# EAGLE design milligrids_v05_single board (EAGLE 6.6.0)
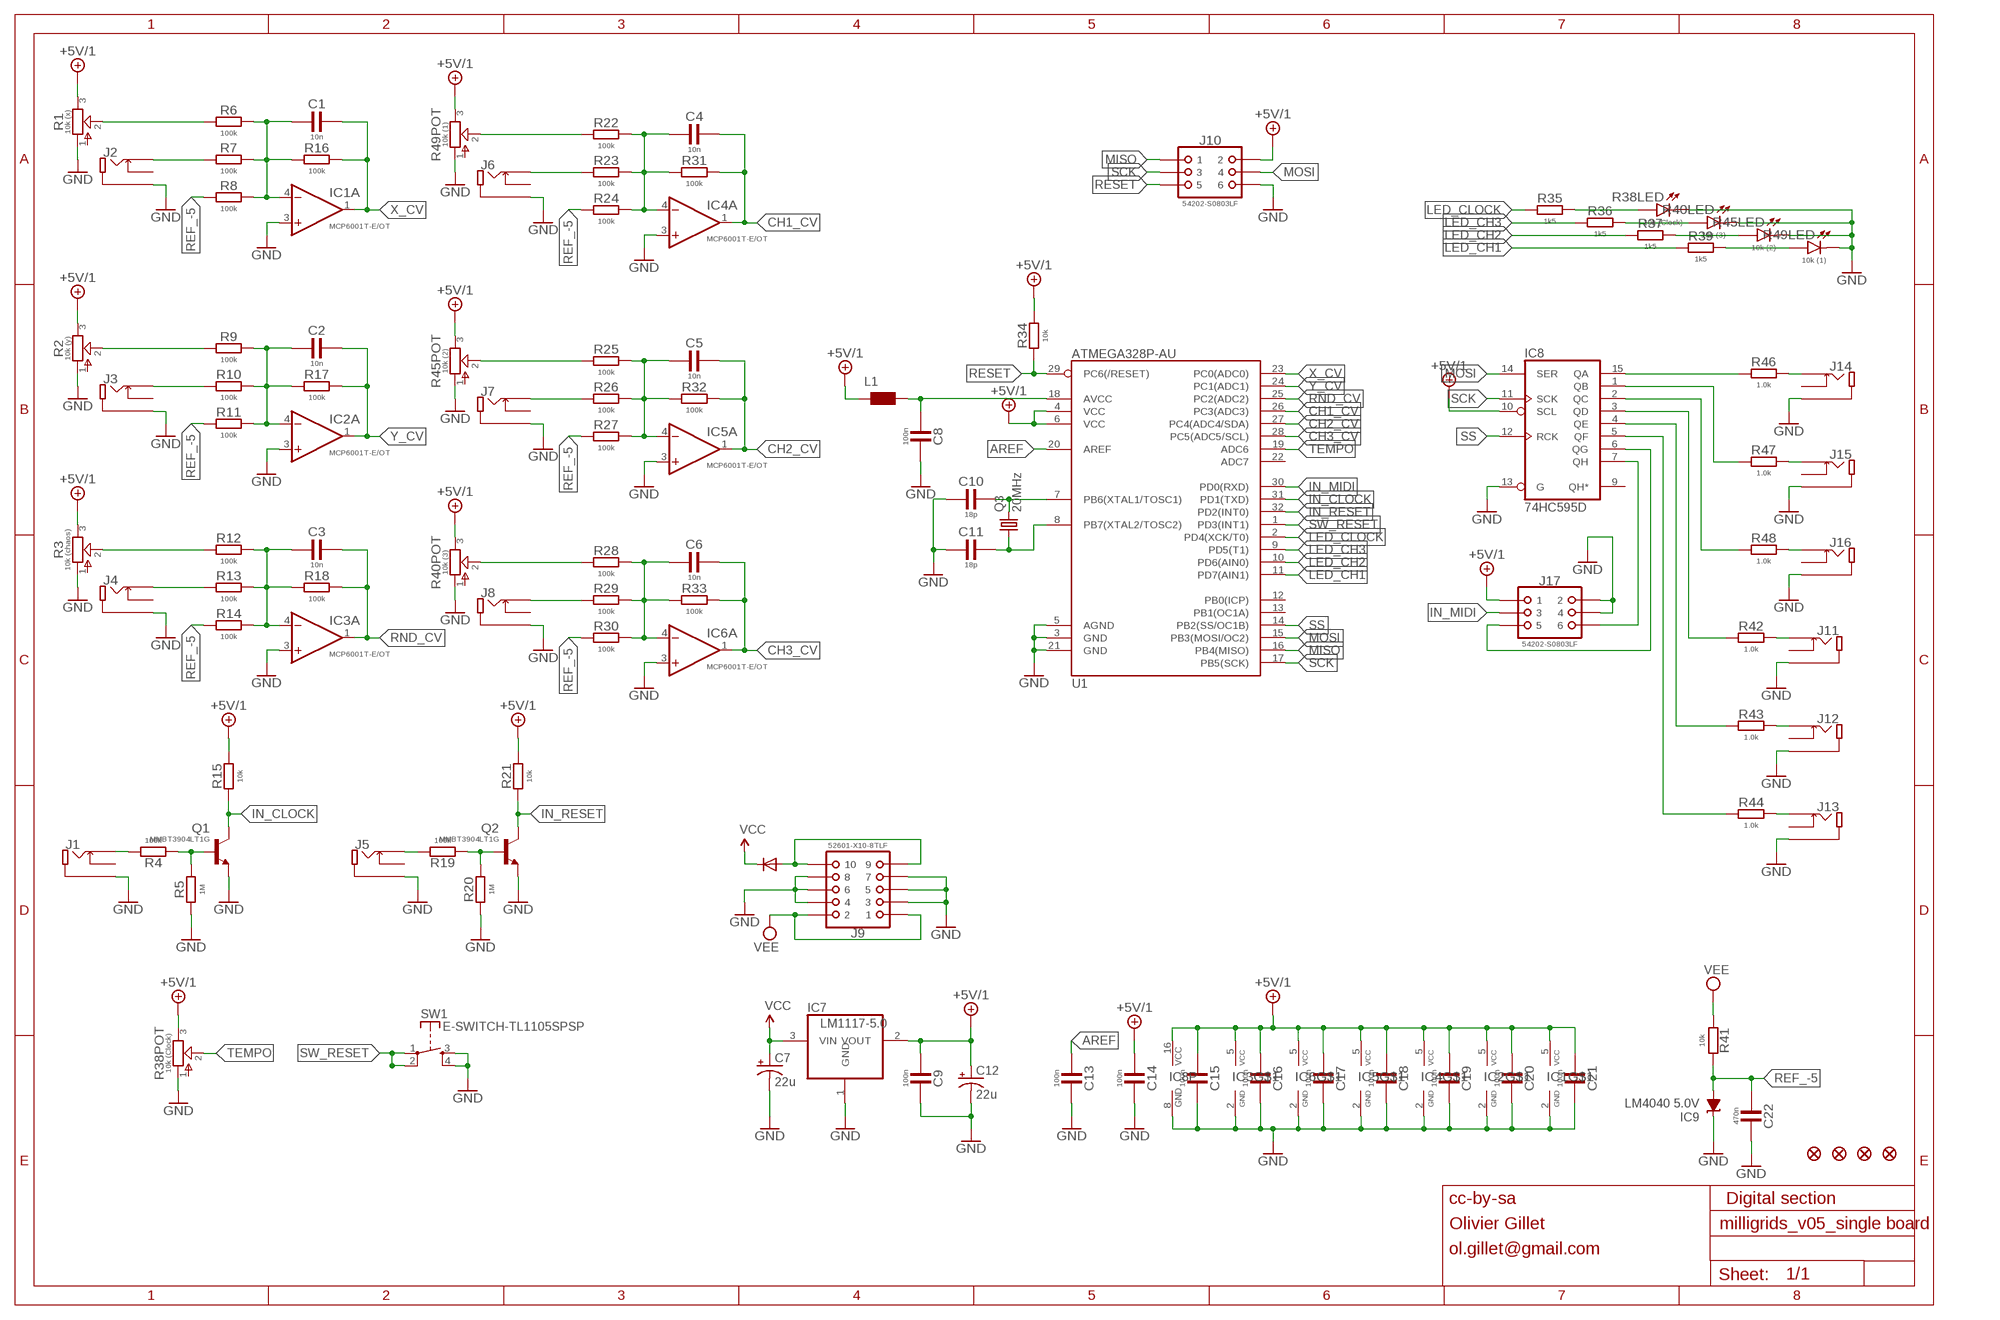
[diagram p0: schematic, sheet 1]

## Parts
C1  10n  C0805  [C0805]
C2  10n  C0805  [C0805]
C3  10n  C0805  [C0805]
C4  10n  C0603  [C0603]
C5  10n  C0603  [C0603]
C6  10n  C0603  [C0603]
C7  22u  CPOL-USC  [PANASONIC_C]
C8  100n  C0805  [C0805]
C9  100n  C0805  [C0805]
C10  18p  C0603  [C0603]
C11  18p  C0603  [C0603]
C12  22u  CPOL-USC  [PANASONIC_C]
C13  100n  C0805  [C0805]
C14  100n  C0805  [C0805]
C15  100n  C0805  [C0805]
C16  100n  C0805  [C0805]
C17  100n  C0805  [C0805]
C18  100n  C0805  [C0805]
C19  100n  C0805  [C0805]
C20  100n  C0805  [C0805]
C21  100n  C0805  [C0805]
C22  470n  C0805  [C0805]
D1  1N5819HW  DIODE-SOD123  [SOD123]
IC1  MCP6001T-E/OT  [SOT23-5]
IC2  MCP6001T-E/OT  [SOT23-5]
IC3  MCP6001T-E/OT  [SOT23-5]
IC4  MCP6001T-E/OT  [SOT23-5]
IC5  MCP6001T-E/OT  [SOT23-5]
IC6  MCP6001T-E/OT  [SOT23-5]
IC7  LM1117-5.0  REG1117  [SOT223]
IC8  74HC595D  [SO16]
IC9  LM4040 5.0V  LM4041C12DBZ  [DBZ_R-PDSO-G3]
J1  WQP-PJ301M6(THONKICONN)  [WQP-PJ301M6(THONKICONN)]
J2  WQP-PJ301M6(THONKICONN)  [WQP-PJ301M6(THONKICONN)]
J3  WQP-PJ301M6(THONKICONN)  [WQP-PJ301M6(THONKICONN)]
J4  WQP-PJ301M6(THONKICONN)  [WQP-PJ301M6(THONKICONN)]
J5  WQP-PJ301M6(THONKICONN)  [WQP-PJ301M6(THONKICONN)]
J6  WQP-PJ301M6(THONKICONN)  [WQP-PJ301M6(THONKICONN)]
J7  WQP-PJ301M6(THONKICONN)  [WQP-PJ301M6(THONKICONN)]
J8  WQP-PJ301M6(THONKICONN)  [WQP-PJ301M6(THONKICONN)]
J9  52601-X10-8TLF  [52601-(X)10-8TLF]
J10  54202-S0803LF  [54202-S0803LF]
J11  WQP-PJ301M6(THONKICONN)  [WQP-PJ301M6(THONKICONN)]
J12  WQP-PJ301M6(THONKICONN)  [WQP-PJ301M6(THONKICONN)]
J13  WQP-PJ301M6(THONKICONN)  [WQP-PJ301M6(THONKICONN)]
J14  WQP-PJ301M6(THONKICONN)  [WQP-PJ301M6(THONKICONN)]
J15  WQP-PJ301M6(THONKICONN)  [WQP-PJ301M6(THONKICONN)]
J16  WQP-PJ301M6(THONKICONN)  [WQP-PJ301M6(THONKICONN)]
J17  54202-S0803LF  [54202-S0803LF]
JP2  FIDUCIAL1X2  [FIDUCIAL-1X2]
JP3  FIDUCIAL1X2  [FIDUCIAL-1X2]
JP4  FIDUCIAL1X2  [FIDUCIAL-1X2]
JP5  FIDUCIAL1X2  [FIDUCIAL-1X2]
L1  WE-CBF_0603  [0603]
Q1  MMBT3904LT1G  [SOT23-3]
Q2  MMBT3904LT1G  [SOT23-3]
Q3  20MHz  CRYSTALHC49UP  [HC49UP]
R1  10k (x)  SONGHUEI-RK0914  [SONGHUEI-RK0914]
R2  10k (y)  SONGHUEI-RK0914  [SONGHUEI-RK0914]
R3  10k (chaos)  SONGHUEI-RK0914  [SONGHUEI-RK0914]
R4  100k  R0603  [R0603]
R5  1M  R0603  [R0603]
R6  100k  R0603  [R0603]
R7  100k  R0603  [R0603]
R8  100k  R0603  [R0603]
R9  100k  R0603  [R0603]
R10  100k  R0603  [R0603]
R11  100k  R0603  [R0603]
R12  100k  R0603  [R0603]
R13  100k  R0603  [R0603]
R14  100k  R0603  [R0603]
R15  10k  R0805  [R0805]
R16  100k  R0603  [R0603]
R17  100k  R0603  [R0603]
R18  100k  R0603  [R0603]
R19  100k  R0603  [R0603]
R20  1M  R0603  [R0603]
R21  10k  R0805  [R0805]
R22  100k  R0603  [R0603]
R23  100k  R0603  [R0603]
R24  100k  R0603  [R0603]
R25  100k  R0603  [R0603]
R26  100k  R0603  [R0603]
R27  100k  R0603  [R0603]
R28  100k  R0603  [R0603]
R29  100k  R0603  [R0603]
R30  100k  R0603  [R0603]
R31  100k  R0603  [R0603]
R32  100k  R0603  [R0603]
R33  100k  R0603  [R0603]
R34  10k  R0805  [R0805]
R35  1k5  R0805  [R0805]
R36  1k5  R0805  [R0805]
R37  1k5  R0805  [R0805]
R38  10k (Clock)  BOURNS-PTL30  [BOURNS-PTL30]
R39  1k5  R0805  [R0805]
R40  10k (3)  BOURNS-PTL30  [BOURNS-PTL30]
R41  10k  R0805  [R0805]
R42  1.0k  R0805  [R0805]
R43  1.0k  R0805  [R0805]
R44  1.0k  R0805  [R0805]
R45  10k (2)  BOURNS-PTL30  [BOURNS-PTL30]
R46  1.0k  R0805  [R0805]
R47  1.0k  R0805  [R0805]
R48  1.0k  R0805  [R0805]
R49  10k (1)  BOURNS-PTL30  [BOURNS-PTL30]
SW1  E-SWITCH-TL1105SPSP  [E-SWITCH-TL1105SP]
U1  ATMEGA328P-AU  ATMEGA168  [TQFP32-08]

## Nets
+5V/1: C9.1 C12.+ C14.1 C15.1 C16.1 C17.1 C18.1 C19.1 C20.1 C21.1 IC1.5(VCC) IC2.5(VCC) IC3.5(VCC) IC4.5(VCC) IC5.5(VCC) IC6.5(VCC) IC7.2(VOUT) IC8.10(SCL) IC8.16(VCC) J10.2 J17.1 L1.1 R1.3 R2.3 R3.3 R15.2 R21.2 R34.2 R38.3 R40.3 R45.3 R49.3 U1.4(VCC) U1.6(VCC)
AREF: C13.1 U1.20(AREF)
CH1_ACC: J11.P3 R42.2
CH1_CV: C4.2 IC4.1(A:OUT) R31.2 U1.26(PC3(ADC3))
CH1_JACK: J6.P3 R23.1
CH1_LED: R39.2 R49.B(LED:A)
CH1_POT: R22.1 R49.2
CH1_TRIG: J14.P3 R46.2
CH2_ACC: J12.P3 R43.2
CH2_CV: C5.2 IC5.1(A:OUT) R32.2 U1.27(PC4(ADC4/SDA))
CH2_JACK: J7.P3 R26.1
CH2_LED: R37.2 R45.B(LED:A)
CH2_POT: R25.1 R45.2
CH2_TRIG: J15.P3 R47.2
CH3_ACC: J13.P3 R44.2
CH3_CV: C6.2 IC6.1(A:OUT) R33.2 U1.28(PC5(ADC5/SCL))
CH3_JACK: J8.P3 R29.1
CH3_LED: R36.2 R40.B(LED:A)
CH3_TRIG: J16.P3 R48.2
CH_POT: R28.1 R40.2
CLK_LED: R35.2 R38.B(LED:A)
CLOCK_OUT: IC8.6(QG) J17.5
GATE1_IN: J1.P3 R4.2
GATE2_IN: J5.P3 R19.2
GND: C7.- C8.2 C9.2 C10.1 C11.1 C12.- C13.2 C14.2 C15.2 C16.2 C17.2 C18.2 C19.2 C20.2 C21.2 C22.2 IC1.2(GND) IC1.3(A:+IN) IC2.2(GND) IC2.3(A:+IN) IC3.2(GND) IC3.3(A:+IN) IC4.2(GND) IC4.3(A:+IN) IC5.2(GND) IC5.3(A:+IN) IC6.2(GND) IC6.3(A:+IN) IC7.1(GND) IC8.8(GND) IC8.13(G) IC9.1(C) J1.P1 J2.P1 J3.P1 J4.P1 J5.P1 J6.P1 J7.P1 J8.P1 J9.3 J9.4 J9.5 J9.6 J9.7 J9.8 J10.6 J11.P1 J12.P1 J13.P1 J14.P1 J15.P1 J16.P1 J17.2 J17.4 Q1.2(E) Q2.2(E) R1.1 R2.1 R3.1 R5.1 R20.1 R38.1 R38.E(LED:K) R40.1 R40.E(LED:K) R45.1 R45.E(LED:K) R49.1 R49.E(LED:K) SW1.3 SW1.4 U1.3(GND) U1.5(AGND) U1.21(GND)
IN_CLOCK: Q1.3(C) R15.1 U1.31(PD1(TXD))
IN_MIDI: J17.3 U1.30(PD0(RXD))
IN_RESET: Q2.3(C) R21.1 U1.32(PD2(INT0))
LED_CH1: R39.1 U1.11(PD7(AIN1))
LED_CH2: R37.1 U1.10(PD6(AIN0))
LED_CH3: R36.1 U1.9(PD5(T1))
LED_CLOCK: R35.1 U1.2(PD4(XCK/T0))
MISO: J10.1 U1.16(PB4(MISO))
MOSI: IC8.14(SER) J10.4 U1.15(PB3(MOSI/OC2))
N$1: Q1.1(B) R4.1 R5.2
N$2: Q2.1(B) R19.1 R20.2
N$3: D1.A J9.9 J9.10
N$12: C2.1 IC2.4(A:-IN) R9.2 R10.2 R11.2 R17.1
N$15: C3.1 IC3.4(A:-IN) R12.2 R13.2 R14.2 R18.1
N$18: C4.1 IC4.4(A:-IN) R22.2 R23.2 R24.2 R31.1
N$21: C5.1 IC5.4(A:-IN) R25.2 R26.2 R27.2 R32.1
N$24: C6.1 IC6.4(A:-IN) R28.2 R29.2 R30.2 R33.1
N$27: IC8.15(QA) R46.1
N$28: IC8.1(QB) R47.1
N$29: C1.1 IC1.4(A:-IN) R6.2 R7.2 R8.2 R16.1
N$30: IC8.2(QC) R48.1
N$31: IC8.3(QD) R42.1
N$32: IC8.4(QE) R43.1
N$33: IC8.5(QF) R44.1
N$39: C8.1 L1.2 U1.18(AVCC)
N$82: C11.2 Q3.1 U1.8(PB7(XTAL2/TOSC2))
N$83: C10.2 Q3.2 U1.7(PB6(XTAL1/TOSC1))
RANDOM_GATE: IC8.7(QH) J17.6
REF_-5: C22.1 IC9.2(A) R8.1 R11.1 R14.1 R24.1 R27.1 R30.1 R41.2
RESET: J10.5 R34.1 U1.29(PC6(/RESET))
RND_CV: C3.2 IC3.1(A:OUT) R18.2 U1.25(PC2(ADC2))
RND_JACK: J4.P3 R13.1
RND_POT: R3.2 R12.1
SCK: IC8.11(SCK) J10.3 U1.17(PB5(SCK))
SS: IC8.12(RCK) U1.14(PB2(SS/OC1B))
SW_RESET: SW1.1 SW1.2 U1.1(PD3(INT1))
TEMPO: R38.2 U1.19(ADC6)
VCC: C7.+ D1.C IC7.3(VIN)
VEE: J9.1 J9.2 R41.1
X_CV: C1.2 IC1.1(A:OUT) R16.2 U1.23(PC0(ADC0))
X_JACK: J2.P3 R7.1
X_POT: R1.2 R6.1
Y_CV: C2.2 IC2.1(A:OUT) R17.2 U1.24(PC1(ADC1))
Y_JACK: J3.P3 R10.1
Y_POT: R2.2 R9.1
Unconnected: IC8.9(QH*) J1.P2 J2.P2 J3.P2 J4.P2 J5.P2 J6.P2 J7.P2 J8.P2 J11.P2 J12.P2 J13.P2 J14.P2 J15.P2 J16.P2 U1.12(PB0(ICP)) U1.13(PB1(OC1A)) U1.22(ADC7)

## Notes on the sheet
- cc-by-sa | Digital section
- Olivier Gillet
- ol.gillet@gmail.com

## Library data of the parts
C1-C3 C8 C9 C13-C22 = 0_taktaktak_m020:C0805: Capacitor 0805 Package
C4-C6 C10 C11 = 0_taktaktak_m020:C0603: Capacitor 0603 Package
C7 C12 = rcl:CPOL-US: POLARIZED CAPACITOR, American symbol
D1 = diode:DIODE-: DIODE
IC1-IC6 = 0_taktaktak_m020:MCP6001
IC7 = og-vreg:REG1117: 800mA and 1A Low Dropout (LDO) Positive Regulator 1.8V, 2.5V, 2.85V, 3.3V, 5V, and Adj
IC8 = 74xx-eu:74*595: 8-bit SHIFT REGISTER, output latch
IC9 = texas:LM4041: PRECISION MICROPOWER SHUNT VOLTAGE REFERENCE Source: http://focus.ti.com/lit/ds/slcs146e/slcs146e.pdf
J1-J8 J11-J16 = 0_taktaktak_m020:WQP-PJ301M6(THONKICONN)
J9 = 0_taktaktak_m020:52601-X10-8TLF
J10 J17 = 0_taktaktak_m020:54202-S0803LF
JP2-JP5 = SparkFun:FIDUCIAL: Fiducial Alignment Points Various fiducial points for machine vision alignment.
L1 = wuerth-elektronik:WE-CBF: SMD EMI Suppression Ferrite Beads - excellent anti-EMI properties - low DCR - impedances till 3000 ohms - rated current up to 6 A
Q1 Q2 = 0_taktaktak_m020:MMBT3904LT1G
Q3 = crystal:CRYSTAL: CRYSTAL
R1-R3 = 0_taktaktak_m020:SONGHUEI-RK0914: SONG HUEI RK0914 9mm POTENTIOMETER
R4-R14 R16-R20 R22-R33 = 0_taktaktak_m020:R0603: Resistor 0603 Package
R15 R21 R34-R37 R39 R41-R44 R46-R48 = 0_taktaktak_m020:R0805: Resistor 0805 Package
R38 R40 R45 R49 = 0_taktaktak_m020:BOURNS-PTL30
SW1 = 0_taktaktak m-series:E-SWITCH-TL1105SP: E-SWITCH TL1105SPxxx
U1 = SparkFun:ATMEGA168

## Board
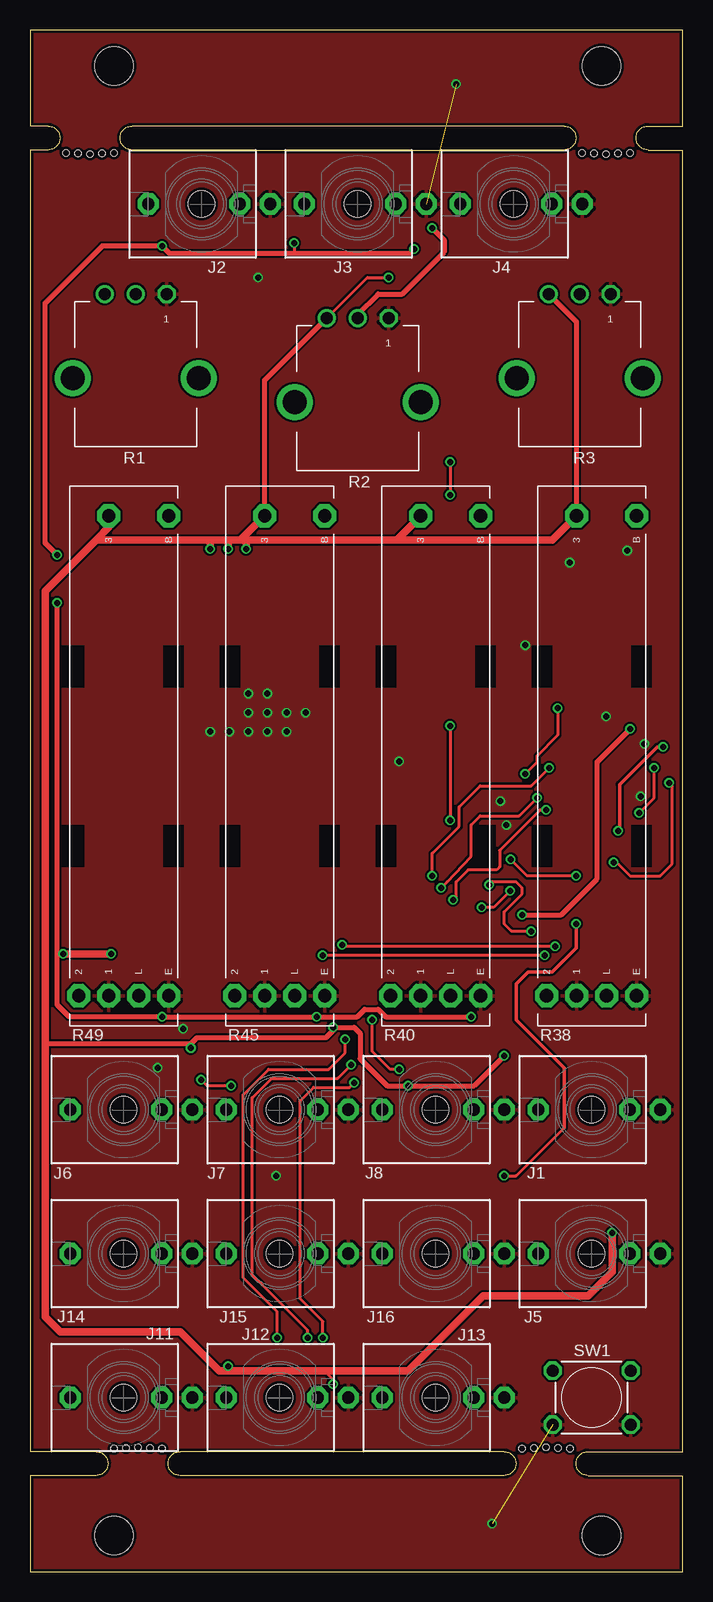
[diagram p1: board, top side]
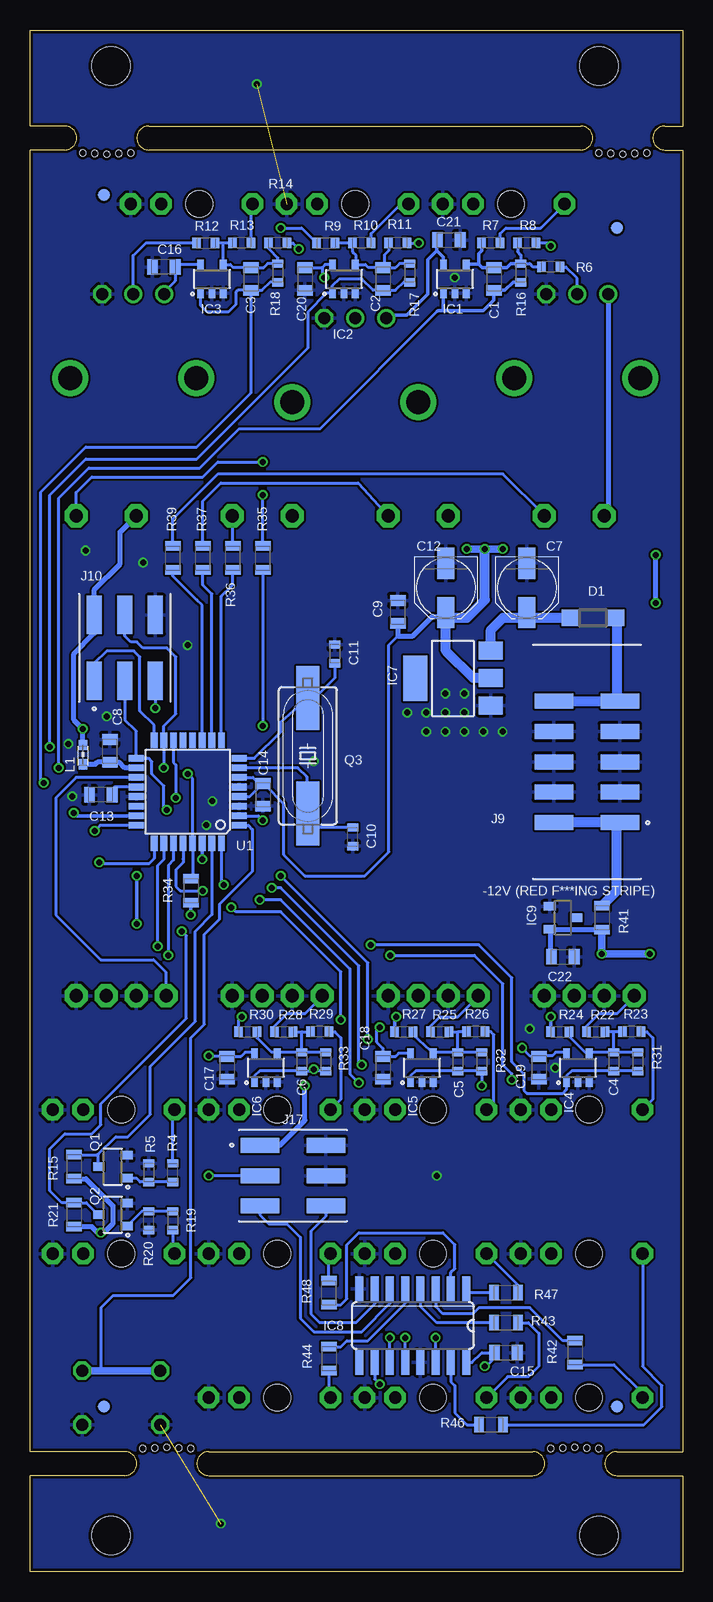
[diagram p2: board, bottom side, seen from below]

Size 54.4 x 128.5 mm. Coordinates in mm from the lower left corner, seen from the top.
Outline: 5.5,10 arc-180 5.5,8
Outline: 12.5,8 arc-180 12.5,10
Outline: 5.5,10 arc-180 5.5,8
Outline: 12.5,8 arc-180 12.5,10
Outline: 39.5,10 arc-180 39.5,8
Outline: 46.5,8 arc-180 46.5,10
Outline: 39.5,10 arc-180 39.5,8
Outline: 46.5,8 arc-180 46.5,10
Outline: 51.5,118.5 arc-180 51.5,120.5
Outline: 44.5,120.5 arc-180 44.5,118.5
Outline: 51.5,118.5 arc-180 51.5,120.5
Outline: 44.5,120.5 arc-180 44.5,118.5
Outline: 8.5,118.5 arc-180 8.5,120.5
Outline: 1.5,120.5 arc-180 1.5,118.5
Outline: 8.5,118.5 arc-180 8.5,120.5
Outline: 1.5,120.5 arc-180 1.5,118.5
Outline: 1.5,120.5 0,120.5 0,128.5 54.4,128.5 54.4,120.5 51.5,120.5
Outline: 1.5,118.5 0,118.5 0,10 5.5,10
Outline: 51.5,118.5 54.4,118.5 54.4,10 46.5,10
Outline: 44.5,120.5 8.5,120.5
Outline: 8.5,118.5 44.5,118.5
Outline: 5.5,8 0,8 0,0 54.4,0 54.4,8 46.5,8
Outline: 39.5,10 12.5,10
Outline: 39.5,8 12.5,8
Copper layers (1*16): Top 0.035mm / dielectric 1.5mm / Bottom 0.035mm
Design rules "dirt_cheap_dirty_boards_TAKTAKTAK.v1": minimum track width 5mil, minimum drill 12mil, track to track 7mil, track to pad 7mil, pad to pad 6mil, via to via 7mil, smd to smd 0mil, copper to edge 10mil, drill to drill 10mil, minimum pad ring 10mil, minimum via ring 6mil, stop-mask expansion 2mil, vias tented up to drill 25mil, thermal gap 10mil
Holes 0.5 mm at 10,10.3 8,10.3 9,10.35 7,10.25 11,10.25 44,10.3 42,10.3 43,10.35 41,10.25 45,10.25 47,118.2 49,118.2 48,118.15 50,118.25 46,118.25 4,118.2 6,118.2 5,118.15 7,118.25 3,118.25
Holes 3.2 mm at 7,125.5 7,3 47.64,3 47.64,125.5

### Footprints (pad centres in the part's own frame; a part is rotated, then mirrored left to right if it is on the bottom)
C0805 = smd 0.9 x 1.3: 1 -0.95,0; 2 0.95,0
C0603 = smd 0.7 x 0.9: 1 -0.775,0; 2 0.775,0
PANASONIC_C = smd 2.6 x 1.4: + 2.05,0; - -2.05,0
SOD123 = smd 1.4 x 1.4: A 1.9,0; C -1.9,0
SOT23-5 = smd 0.8 x 0.55: 1 -1.2,0.95; 2 -1.2,0; 3 -1.2,-0.95; 4 1.2,-0.95; 5 1.2,0.95
SOT223 = smd 1.499 x 2.007: 1 -2.261,-3.15; 2 0.025,-3.15; 3 2.311,-3.15 | smd 3.81 x 2.007: 4 0,3.15
SO16 = smd 0.66 x 2.032: 1 -4.445,-3.073; 2 -3.175,-3.073; 3 -1.905,-3.073; 4 -0.635,-3.073; 5 0.635,-3.073; 6 1.905,-3.073; 7 3.175,-3.073; 8 4.445,-3.073; 9 4.445,3.073; 10 3.175,3.073; 11 1.905,3.073; 12 0.635,3.073; 13 -0.635,3.073; 14 -1.905,3.073; 15 -3.175,3.073; 16 -4.445,3.073
DBZ_R-PDSO-G3 = smd 0.7 x 1: 1 -0.95,-1.1; 2 0.95,-1.1; 3 0,1.1
WQP-PJ301M6(THONKICONN) = drill 1.016 pad 1.778 octagon: P1 0,5.715; P2 0,3.175; P3 0,-4.445 | hole 2.2: 0,0
52601-(X)10-8TLF = smd 3.2 x 1.25: 1 -2.75,5.08; 2 2.75,5.08; 3 -2.75,2.54; 4 2.75,2.54; 5 -2.75,0; 6 2.75,0; 7 -2.75,-2.54; 8 2.75,-2.54; 9 -2.75,-5.08; 10 2.75,-5.08
54202-S0803LF = smd 3.2 x 1.25: 1 -2.75,2.54; 2 2.75,2.54; 3 -2.75,0; 4 2.75,0; 5 -2.75,-2.54; 6 2.75,-2.54
FIDUCIAL-1X2 = smd 1 x 1: 1 0,0
0603 = smd 0.85 x 0.7: 1 -0.9,0; 2 0.7,0
SOT23-3 = smd 0.9 x 0.7: 1 -1.2,0.95; 2 -1.2,-0.95; 3 1.2,0
HC49UP = smd 5.334 x 1.93: 1 -4.826,0; 2 4.826,0
SONGHUEI-RK0914 = drill 1 octagon: 1 -2.58,-6.985 | drill 1: 2 0,-6.985; 3 2.58,-6.985 | drill 2: 4 -5.25,0.015; 5 5.25,0.015
R0603 = smd 0.7 x 0.9: 1 -0.775,0; 2 0.775,0
R0805 = smd 0.8 x 1.3: 1 -1,0; 2 1,0
BOURNS-PTL30 = drill 1.1 pad 1.93 octagon: 1 -20,1.25; 2 -20,3.75; 3 20,1.25; B 20,-3.75; E -20,-3.75; L -20,-1.25
E-SWITCH-TL1105SP = drill 1 octagon: 1 -3.25,-2.25; 2 3.25,-2.25; 3 -3.25,2.25; 4 3.25,2.25
TQFP32-08 = smd 1.27 x 0.559: 1 -4.293,2.8; 2 -4.293,2; 3 -4.293,1.2; 4 -4.293,0.4; 5 -4.293,-0.4; 6 -4.293,-1.2; 7 -4.293,-2; 8 -4.293,-2.8; 17 4.293,-2.8; 18 4.293,-2; 19 4.293,-1.2; 20 4.293,-0.4; 21 4.293,0.4; 22 4.293,1.2; 23 4.293,2; 24 4.293,2.8 | smd 0.559 x 1.27: 9 -2.8,-4.293; 10 -2,-4.293; 11 -1.2,-4.293; 12 -0.4,-4.293; 13 0.4,-4.293; 14 1.2,-4.293; 15 2,-4.293; 16 2.8,-4.293; 25 2.8,4.293; 26 2,4.293; 27 1.2,4.293; 28 0.4,4.293; 29 -0.4,4.293; 30 -1.2,4.293; 31 -2,4.293; 32 -2.8,4.293

### Placement (x,y rotation side)
C1  15.75,107.75 270 bottom
C2  25,107.75 270 bottom
C3  36,107.75 270 bottom
C4  5.75,42.5 270 bottom
C5  18.75,42.5 270 bottom
C6  31.75,42.5 270 bottom
C7  13,82 270 bottom
C8  47.75,68.42 90 bottom
C9  23.75,80 90 bottom
C10  27.5,61.25 90 bottom
C11  29,76.5 270 bottom
C12  19.75,82 270 bottom
C13  48.5,64.75 180 bottom
C14  35,64.75 270 bottom
C15  14.75,18.25 0 bottom
C16  43.25,108.75 180 bottom
C17  38,42 270 bottom
C18  25,42 270 bottom
C19  12,42 270 bottom
C20  31.5,107.75 270 bottom
C21  19.5,111 0 bottom
C22  10,51.25 0 bottom
D1  7.5,79.5 0 bottom
IC1  19,107.75 90 bottom
IC2  28.25,107.75 90 bottom
IC3  39.25,107.75 90 bottom
IC4  8.75,42 90 bottom
IC5  21.75,42 90 bottom
IC6  34.75,42 90 bottom
IC7  19.15,74.45 90 bottom
IC8  22.5,20.5 180 bottom
IC9  10,54.5 270 bottom
J1  46.8,38.5 270 top
J2  14.3,114 270 top
J3  27.3,114 270 top
J4  40.3,114 270 top
J5  46.8,26.5 270 top
J6  7.8,38.5 270 top
J7  20.8,38.5 270 top
J8  33.8,38.5 270 top
J9  8,67.5 180 bottom
J10  46.5,77 90 bottom
J11  7.8,14.5 270 top
J12  20.8,14.5 270 top
J13  33.8,14.5 270 top
J14  7.8,26.5 270 top
J15  20.8,26.5 270 top
J16  33.8,26.5 270 top
J17  32.5,33 0 bottom
JP2  5.5,112 90 bottom
JP3  48.25,114.75 90 bottom
JP4  48.25,13.75 90 bottom
JP5  5.5,13.75 90 bottom
L1  50,68 270 bottom
Q1  47.5,33.75 180 bottom
Q2  47.5,29.75 180 bottom
Q3  31.25,68 270 bottom
R1  8.8,99.5 180 top
R2  27.3,97.5 180 top
R3  45.8,99.5 180 top
R4  42.5,33.25 90 bottom
R5  44.5,33.25 270 bottom
R6  11,108.75 180 bottom
R7  16,110.75 180 bottom
R8  13,110.75 180 bottom
R9  29.75,110.75 0 bottom
R10  26.75,110.75 180 bottom
R11  23.75,110.75 180 bottom
R12  39.75,110.75 0 bottom
R13  36.75,110.75 180 bottom
R14  33.75,110.75 180 bottom
R15  50.75,33.75 270 bottom
R16  13.5,108.25 270 bottom
R17  22.75,108.25 270 bottom
R18  33.75,108.25 270 bottom
R19  42.5,29.25 270 bottom
R20  44.5,29.25 90 bottom
R21  50.75,29.75 270 bottom
R22  7.25,45 0 bottom
R23  4.25,45 180 bottom
R24  10.25,45 0 bottom
R25  20.25,45 0 bottom
R26  17.25,45 180 bottom
R27  23.25,45 0 bottom
R28  33.25,45 0 bottom
R29  30.25,45 180 bottom
R30  36.25,45 0 bottom
R31  3.75,42.5 270 bottom
R32  16.75,42.5 270 bottom
R33  29.75,42.5 270 bottom
R34  41,56.75 270 bottom
R35  35,84.5 90 bottom
R36  37.5,84.5 90 bottom
R37  40,84.5 90 bottom
R38  46.8,68 90 top
R39  42.5,84.5 90 bottom
R40  33.8,68 90 top
R41  6.75,54.5 270 bottom
R42  9,18.25 270 bottom
R43  14.75,20.75 0 bottom
R44  29.5,17.75 270 bottom
R45  20.8,68 90 top
R46  16,12.25 0 bottom
R47  14.75,23.25 0 bottom
R48  29.5,23.25 90 bottom
R49  7.8,68 90 top
SW1  46.8,14.5 180 top
U1  41.25,65 180 bottom

### Tracks (layer width: path | path; a pad name or v marks a point on that pad's centre or on a via)
+5V/1  (via drill 0.5)
  Top 0.254: R2.3 28.11,107.88 v29.88,107.88 | v25.25,15.62 25.25,16 24.5,16.75 | v25.25,45.38 25.5,45.38
  Top 0.406: R45.3 19.55,99.31 R2.3 | 13.4,44 1.25,44 | 13.4,44 13.9,44.5 24.62,44.5 25.5,45.38 27,45.38 27.5,44.88 27.5,42.75 29.75,40.5 v31.5,40.5 37,40.5 v39.5,43 | v13.4,43.65 13.4,44 | R38.3 45.55,104.16 R3.3 | v41,54.75 44.25,54.75 47.25,57.75 47.25,67.5 v50,70.25
  Top 0.61: 16.25,16.75 15.75,16.75 12.5,20 2.5,20 1.25,21.25 1.25,44 1.25,81.75 5.5,86 | 16.25,16.75 24.5,16.75 31.5,16.75 37.75,23 46.5,23 48.5,25 v48.5,28.25 | v16.5,17.12 16.25,16.75 | 5.5,86 15,86 | 15,86 16.5,86 | 16.5,86 17.5,86 | 17.5,86 18,86 | 18,86 30.55,86 | 30.55,86 R40.3 | R45.3 19.5,88 17.5,86 | R49.3 6.55,87.05 5.5,86 | v18,85.25 18,86 | v16.5,85.25 16.5,86 | R38.3 45.5,88 43.5,86 30.55,86 | v15,85.25 15,86
  Bottom 0.254: 29.27,109.03 IC2.5 29.8,108.95 30.05,108.7 | IC4.5 9.78,43.27 10.6,43.27 10.88,43 11.95,43 C19.1 12.7,42.95 v13.4,43.65 | IC6.5 35.77,43.27 36.48,43.27 36.8,42.95 C17.1 39.45,42.95 v39.5,43 | IC8.16 17.57,17.43 16.75,18.25 C15.1 15.5,18.05 15.5,18 16.38,17.12 v16.5,17.12 | IC8.10 25.68,16.05 v25.25,15.62 | C14.1 34.77,65.53 33.25,64 33.25,59.75 31.5,58 26.5,58 24.5,60 24.5,77.25 23.75,78 | U1.4 36.1,64.6 C14.1 | IC3.5 42.1,108.95 C16.1 42.3,107.58 43.22,106.66 R3.3 | C20.1 30.05,108.7 | 30.05,108.7 30.05,108.05 v29.88,107.88 | IC5.5 23.68,43.2 23.93,42.95 C18.1 25,43.62 25.5,44.12 25.5,45.12 v25.25,45.38 | U1.6 35.83,66.2 35.5,65.88 35.17,65.88 C14.1
  Bottom 0.305: R34.2 v41,54.75 | 20.5,110.75 20.5,110.12 | 20.5,110.12 21.25,109.38 21.25,106.5 23,104.75 24.45,104.75 R2.3 | IC1.5 19.95,109.58 20.5,110.12
  Bottom 0.406: R21.2 49.25,28.75 48.75,28.25 v48.5,28.25 48.25,28.25 47.5,29 47.5,30.5 49.75,32.75 R15.2 | R1.3 6.22,88.33 R49.3 | 20.5,110.75 C21.1 | R38.3 46.9,86.66 46.9,84 49.04,81.86 J10.2 49.04,78.21 50.75,76.5 50.75,71 v50,70.25 L1.1 | C9.1 23.75,78 22.5,78 20.88,79.62 20.07,79.62 C12.+ | J17.1 33.59,35.54 31.5,37.62 v31.5,40.5
  Bottom 0.61: v15,85.25 v18,85.25
  Bottom 0.813: v16.5,85.25 16.5,81 18,79.5 19.3,79.5 C12.+ 19.75,76.75 17.48,74.48 IC7.2
AREF
  Bottom 0.254: U1.20 47.38,65.4 C13.1
CH1_ACC
  Bottom 0.254: J11.P3 3.35,14.86 5.75,17.25 R42.2
CH1_CV  (via drill 0.5)
  Top 0.254: v43.75,52.12 26.12,52.12 v26,52.25
  Bottom 0.254: R31.2 C4.2 9.28,41.73 9.7,41.3 IC4.1 9.7,40.17 10,39.88 13,39.88 13.25,40.12 13.25,41.5 14.25,42.5 14.25,49.5 17,52.25 v26,52.25 | U1.26 43.25,59.38 43.75,58.88 v43.75,52.12
CH1_JACK
  Bottom 0.254: R23.1 3,45 2.5,44.5 2.5,39.35 J6.P3
CH1_LED
  Bottom 0.254: R49.B 11.55,88.05 15,91.5 38.75,91.5 42.5,87.75 R39.2
CH1_POT
  Bottom 0.254: R49.2 4.05,47.95 5.5,46.5 7,46.5 8.03,45.48 R22.1
CH1_TRIG
  Bottom 0.254: R46.2 3.25,12.25 1.75,13.75 1.75,15.5 3.35,17.11 J14.P3
CH2_ACC
  Bottom 0.254: R43.2 12.88,20.75 12,19.88 12,17.12 12.88,16.25 14.61,16.25 J12.P3
CH2_CV  (via drill 0.5)
  Top 0.254: v16.75,40.5 14.75,40.5 v14.25,41 | v42.88,51.38 v24.38,51.38
  Bottom 0.254: IC5.1 22.7,41.3 22.27,41.73 C5.2 R32.2 v16.75,40.5 | v14.25,41 14.25,41.5 15,42.25 15,49 17.38,51.38 v24.38,51.38 | U1.27 42.45,59.3 42.88,58.88 v42.88,51.38
CH2_JACK
  Bottom 0.254: J7.P3 16.25,38.5 15.75,39 15.75,44.75 16,45 R26.1
CH2_LED
  Bottom 0.254: R37.2 40,89.25 38.5,90.75 27.05,90.75 R45.B
CH2_POT
  Bottom 0.254: R45.2 17.3,47.7 18.75,46.25 20.25,46.25 21.02,45.48 R25.1
CH2_TRIG
  Bottom 0.254: R47.2 13.75,23.89 J15.P3
CH3_ACC
  Bottom 0.254: R44.2 29.5,14.64 J13.P3
CH3_CV  (via drill 0.5)
  Top 0.254: v30.75,41.88 30,41.88 28.5,43.38 v28.5,46 | v40,56.75 38.62,55.38 v37.62,55.38
  Bottom 0.254: IC6.1 35.7,41.3 35.27,41.73 C6.2 30.77,41.73 v30.75,41.88 30.73,41.73 R33.2 | v28.5,46 28.5,50 33.5,55 37.25,55 v37.62,55.38 | U1.28 41.65,59.4 41.63,59.38 41.63,59.12 42.25,58.5 42.25,57.12 41.88,56.75 v40,56.75
CH3_JACK
  Bottom 0.254: R29.1 29,45 28.5,44.5 28.5,39.35 J8.P3
CH3_LED
  Bottom 0.254: R40.B 37.55,85.55 R36.2
CH3_TRIG
  Bottom 0.254: R48.2 29.5,26.36 J16.P3
CH_POT
  Bottom 0.254: R40.2 30.05,47.95 31.5,46.5 33,46.5 34.02,45.48 R28.1
CLK_LED  (via drill 0.5)
  Top 0.254: v35,92.5 v35,89.75
  Bottom 0.254: R38.B 50.55,89.95 49.25,91.25 40,91.25 38.75,92.5 v35,92.5 | R35.2 v35,89.75
CLOCK_OUT
  Bottom 0.254: IC8.6 24.41,22.34 26.75,20 30.75,20 31.88,21.12 31.88,27.88 33,29 34.5,29 35.25,29.75 J17.5
GATE1_IN
  Bottom 0.254: R4.2 42.5,38.35 J1.P3
GATE2_IN
  Bottom 0.254: R19.2 42.5,26.64 J5.P3
GND  (via drill 0.5)  (2 unrouted)
  other vias: 39.2,64.22 30.76,67.53 18.2,73.19 18.2,71.6 19.79,73.19 19.79,71.6 18.2,70.01 16.61,70.01 19.79,70.01 15.03,70.01 21.38,70.01 21.38,71.6 22.96,71.6 10.62,42 20.5,33 12.75,45.25 50.88,64.62 48.01,71.28 51.2,69 38.5,4 35.5,124 44.98,84.11 49.77,85.11 41.27,77.21 19,107.88 39.7,62.22
  pour Bottom: 0,0 54.4,0 54.4,128.5 0,128.5
  pour Top: 0,128.5 54.4,128.5 54.4,0 0,0
IN_CLOCK
  Bottom 0.254: R15.1 48.75,34.75 48.7,34.8 | Q1.3 48.7,34.8 | 48.7,34.8 47.25,36.25 46.25,36.25 44.38,38.12 44.38,42.12 40.62,45.88 40.62,53.38 39.23,54.77 U1.31
IN_MIDI  (via drill 0.5)
  Top 0.254: v39.5,33 40.5,33 44.5,37 | v45.5,58 41.42,58 v40.05,59.38
  Top 0.305: v40.05,59.38 40.05,59.55 | 44.5,37 44.5,42 40.5,46 40.5,49 41.5,50 43.5,50 45.5,52 v45.5,54
  Bottom 0.254: J17.3 v39.5,33
  Bottom 0.305: U1.30 v40.05,59.38 | v45.5,54 v45.5,58
IN_RESET  (via drill 0.5)
  Top 0.254: v41.75,53.38 40.12,53.38 39.5,54 39.5,55 41,56.5 41,57 40.5,57.5 38.5,57.5 v38.25,57.25
  Bottom 0.254: Q2.3 49.7,30.75 R21.1 51.75,30.75 52.75,31.75 52.75,35.25 51.5,36.5 49.25,36.5 48.5,37.25 48.5,39 41.38,46.12 41.38,53 v41.75,53.38 | U1.32 38.45,57.45 v38.25,57.25
LED_CH1
  Bottom 0.254: R39.1 42.5,83 40.5,81 40.05,80.55 U1.11
LED_CH2
  Bottom 0.254: R37.1 40,82.25 39.25,81.5 U1.10
LED_CH3
  Bottom 0.254: R36.1 37.5,82.25 38.45,81.3 U1.9
LED_CLOCK  (via drill 0.5)
  Top 0.254: v35,70.5 v35,62.62
  Bottom 0.254: U1.2 35.38,63 v35,62.62 | R35.1 v35,70.5
MISO
  Bottom 0.254: U1.16 44.05,70.55 45.25,71.75 45.25,76.25 45.75,76.75 48,76.75 49.04,75.71 J10.1
MOSI  (via drill 0.5)
  Top 0.254: v20.59,19.5 20.59,21.66 17.75,24.5 17.75,39.75 19.88,41.88 24.88,41.88 26.25,43.25 v26.25,44.38 | v43.25,67 41.75,65.5 37.5,65.5 35.75,63.75 35.75,62.12 33.5,59.88 v33.5,58
  Bottom 0.254: IC8.14 v20.59,19.5 | v26.25,44.38 26.25,50.75 v33.5,58 | J10.4 46.5,78 46,77.5 45.5,77.5 45,77 43,77 42.25,76.25 42.25,71.5 43.25,70.5 U1.15 v43.25,67
N$1
  Bottom 0.254: R4.1 R5.2 45.23,32.48 45.55,32.8 Q1.1
N$2
  Bottom 0.254: R19.1 R20.2 45.08,30.02 Q2.1
N$3
  Bottom 0.61: 5.5,72.83 J9.9
  Bottom 0.813: D1.A 5.5,79.4 5.5,72.83 | J9.10 J9.9
N$12
  Bottom 0.254: R9.2 R10.2 27.5,110.72 27.5,110 27.23,109.72 27.23,109.03 IC2.4 26.45,108.95 26.2,108.7 C2.1 | R17.1 23.6,109.03 23.93,108.7 C2.1 | R11.2 24.52,110.1 24.88,109.75 24.88,108.83 C2.1
N$15
  Bottom 0.254: R13.2 38.25,110.75 | 38.25,110.75 R12.2 | 38.25,110.75 38.3,110.7 IC3.4 37.7,108.95 37.45,108.7 C3.1 34.92,108.7 34.6,109.03 R18.1 33.75,109.5 34.52,110.28 R14.2
N$18
  Bottom 0.254: R31.1 C4.1 | C4.1 7.85,43.27 | 7.85,43.27 IC4.4 | R23.2 5.75,45 | 5.75,45 R22.2 | C4.1 5.75,45 | 7.85,43.27 8.15,43.27 9.47,44.6 R24.2
N$21
  Bottom 0.254: R26.2 18.75,45 | R32.1 C5.1 | C5.1 18.75,45 | R25.2 18.75,45 | R27.2 22.48,44.73 21.02,43.4 20.75,43.27 | C5.1 20.75,43.27 | IC5.4 20.8,43.23 20.75,43.27
N$24
  Bottom 0.254: R33.1 C6.1 | C6.1 33.75,43.27 | 33.75,43.27 34.27,43.27 35.48,44.48 R30.2 | IC6.4 33.8,43.23 33.75,43.27 | R28.2 31.75,45 | 31.75,45 R29.2 | C6.1 31.75,45
N$27
  Bottom 0.254: IC8.15 19.32,15.82 19,15.5 19,13.25 18,12.25 R46.1
N$28
  Bottom 0.254: R47.1 17.73,23.25 IC8.1
N$29
  Bottom 0.254: R6.2 12.5,108.75 12.78,109.03 R16.1 13.5,109.75 13.78,110.03 R8.2
  Bottom 0.305: R16.1 14.35,109.03 14.68,108.7 C1.1 16.7,108.7 17,109 | 17,109 18,109 IC1.4 | R7.2 16.77,110.1 17,109.88 17,109
N$30
  Bottom 0.254: R48.1 28.5,22.25 28,22.75 28,27.25 27,28.25 20,28.25 19,27.25 19,25.25 19.32,24.93 IC8.2
N$31
  Bottom 0.254: R42.1 10,19.25 12.75,22 17,22 17.5,21.5 20,21.5 20.59,22.09 IC8.3
N$32
  Bottom 0.254: R43.1 20.5,20.75 21.86,22.11 IC8.4
N$33
  Bottom 0.254: R44.1 28.5,18.75 28,19.25 26.25,19.25 23.14,22.36 IC8.5
N$39
  Bottom 0.406: U1.18 46.5,67 46.97,67.47 C8.1 48.78,67.47 48.95,67.3 L1.2
N$82
  Bottom 0.254: C11.2 29,74.5 30.5,73 31.83,73 Q3.1 33.5,70.83 33.5,70 35.7,67.8 U1.8
N$83
  Bottom 0.254: 31.34,64.34 Q3.2 | 31.34,64.34 31.34,66.26 32.08,66.99 U1.7 | 31.34,64.34 31.34,63 30.37,62.02 C10.2
RANDOM_GATE
  Bottom 0.254: IC8.7 25.68,22.32 27.25,20.75 30.25,20.75 31,21.5 31,28.38 29.75,29.62 J17.6
REF_-5  (via drill 0.5)
  Top 0.254: v22,110.75 22,109.88
  Top 0.406: v36.75,46.25 29.62,46.25 29,46.88 27.88,46.88 27.25,46.25 v23.88,46.25 v11,46.25 3.25,46.25 2.25,47.25 2.25,51.5 | 2.25,51.5 v2.25,80.75 | v2.25,84.75 1.25,85.75 1.25,105.75 6,110.5 v11,110.5 11.62,109.88 22,109.88 31.62,109.88 v32,110.25 | v2.75,51.5 2.25,51.5
  Top 0.61: v6.75,51.5 v2.75,51.5
  Bottom 0.254: v11,110.5 11.25,110.75 R8.1 | R11.1 v22,110.75 | R30.1 37.02,45.98 v36.75,46.25 | R14.1 32.5,110.75 v32,110.25
  Bottom 0.305: R27.1 24.02,46.1 v23.88,46.25 | v11,46.25 11,45.02 R24.1
  Bottom 0.406: v2.25,80.75 v2.25,84.75 | R41.2 11.05,53.5 | 11.05,53.5 IC9.2 | 11.05,53.5 11.05,51.35 C22.1
  Bottom 0.61: R41.2 v6.75,51.5 v2.75,51.5
RESET  (via drill 0.5)
  Top 0.254: v41.25,66.5 42.25,67.5 42.25,68 43.96,69.71 v43.96,71.96
  Bottom 0.254: R34.1 40.85,57.75 U1.29 40.85,66.1 v41.25,66.5 | J10.5 v43.96,71.96
RND_CV  (via drill 0.5)
  Top 0.254: v48.62,59.12 48.88,59.12 50,58 52.5,58 53.5,59 53.5,65.5 v53.25,65.75
  Bottom 0.254: U1.25 44.05,59.45 44.5,59 48.5,59 v48.62,59.12 | C3.2 36,98.25 40.5,93.75 49.75,93.75 53.5,90 53.5,66 v53.25,65.75 | R18.2 34.4,107.47 35.08,106.8 C3.2 | C3.2 37.08,106.8 37.25,106.62 37.25,105.62 37.88,105 39.62,105 40.2,105.58 IC3.1
RND_JACK
  Bottom 0.254: R13.1 35.98,113.88 J4.P3
RND_POT
  Bottom 0.254: R12.1 44.75,110.75 45.8,109.7 R3.2
SCK  (via drill 0.5)
  Top 0.254: v24.41,19.5 24.41,20.84 22.5,22.75 22.5,39.25 23.62,40.38 26.62,40.38 v27,40.75 | v35.25,56 35.5,56.25 35.5,57.5 36.5,58.5 38.88,58.5 39.12,58.75 39.12,60.12 42.5,63.5 v43,63.5
  Bottom 0.254: IC8.11 v24.41,19.5 | v27,40.75 27.75,41.5 27.75,50.25 33.5,56 v35.25,56 | J10.3 46.5,71 45.54,70.04 U1.17 44.55,67.8 44.25,67.5 44.25,66.5 43.25,65.5 43.25,63.75 v43,63.5
SS  (via drill 0.5)
  Top 0.254: v23.14,19.5 23.14,20.11 18.5,24.75 18.5,39.5 20.12,41.12 25.62,41.12 v26.75,42.25 | v34.25,57 34.75,57.5 36.75,59.62 36.75,62.25 37.5,63 40.75,63 v42.25,64.5
  Bottom 0.254: IC8.12 v23.14,19.5 | v26.75,42.25 27,42.5 27,50.5 33.5,57 v34.25,57 | U1.14 42.45,67.45 42.25,67.25 v42.25,64.5
SW_RESET
  Bottom 0.254: SW1.2 43.55,16.95 | U1.1 36.19,62.19 35.88,61.88 35.88,58.38 38.62,55.62 38.62,54.38 39.88,53.12 39.88,45.62 41,44.5 41,24.5 42.5,23 47.5,23 48.5,22 48.5,16.75
  Bottom 0.61: SW1.1 48.5,16.75 SW1.2
TEMPO
  Bottom 0.254: R38.2 43.05,49.95 44.1,51 48.5,51 52.25,54.75 52.25,64.5 50.55,66.2 U1.19
VCC
  Bottom 0.813: D1.C 13.5,79.5 | 13.5,79.5 15,79.5 16,78.5 IC7.3 | C7.+ 13.05,79.95 13.5,79.5
VEE
  Bottom 0.61: 5.5,62.17 J9.1
  Bottom 0.813: R41.1 5.5,56.75 5.5,62.17 | J9.1 J9.2
X_CV  (via drill 0.5)
  Top 0.254: v50.75,63.25 52,64.5 v52,67
  Bottom 0.254: 20.45,105.05 30.25,95.25 37,95.25 40.25,92 49.5,92 52,89.5 v52,67
  Bottom 0.305: R16.2 14.15,107.47 14.82,106.8 C1.2 15.75,106 16.62,105.12 19.88,105.12 | 19.88,105.12 20.38,105.12 20.45,105.05 | IC1.1 19.95,105.2 19.88,105.12 | U1.23 50.5,63 v50.75,63.25
X_JACK
  Bottom 0.254: R7.1 15.22,111.53 14.75,112 11.86,112 J2.P3
X_POT
  Bottom 0.254: R1.2 8.8,107.8 9.75,108.75 R6.1
Y_CV  (via drill 0.5)
  Top 0.305: v52.75,68.75 52.25,68.75 49.12,65.62 49.12,61.88 v49,61.75
  Bottom 0.254: U1.24 48.55,62.2 v49,61.75 | v52.75,68.75 52.75,89.75 49.75,92.75 40.5,92.75 31.25,102 31.25,105 29.7,106.55 IC2.1 29.2,107.17 28.62,107.75 26.75,107.75 25.8,106.8 C2.2 23.95,106.8 23.27,107.47 R17.2
Y_JACK
  Bottom 0.254: J3.P3 23.5,114 25.98,111.53 R10.1
Y_POT  (via drill 0.5)
  Top 0.406: R2.2 27.3,104.8 29,106.5 31,106.5 34.5,110 34.5,111 v33.5,112
  Bottom 0.254: v33.5,112 31.77,112 R9.1

### Text on the board
bNames: -12V (RED F***ING STRIPE)